# Altium project QBW01.PrjPCB
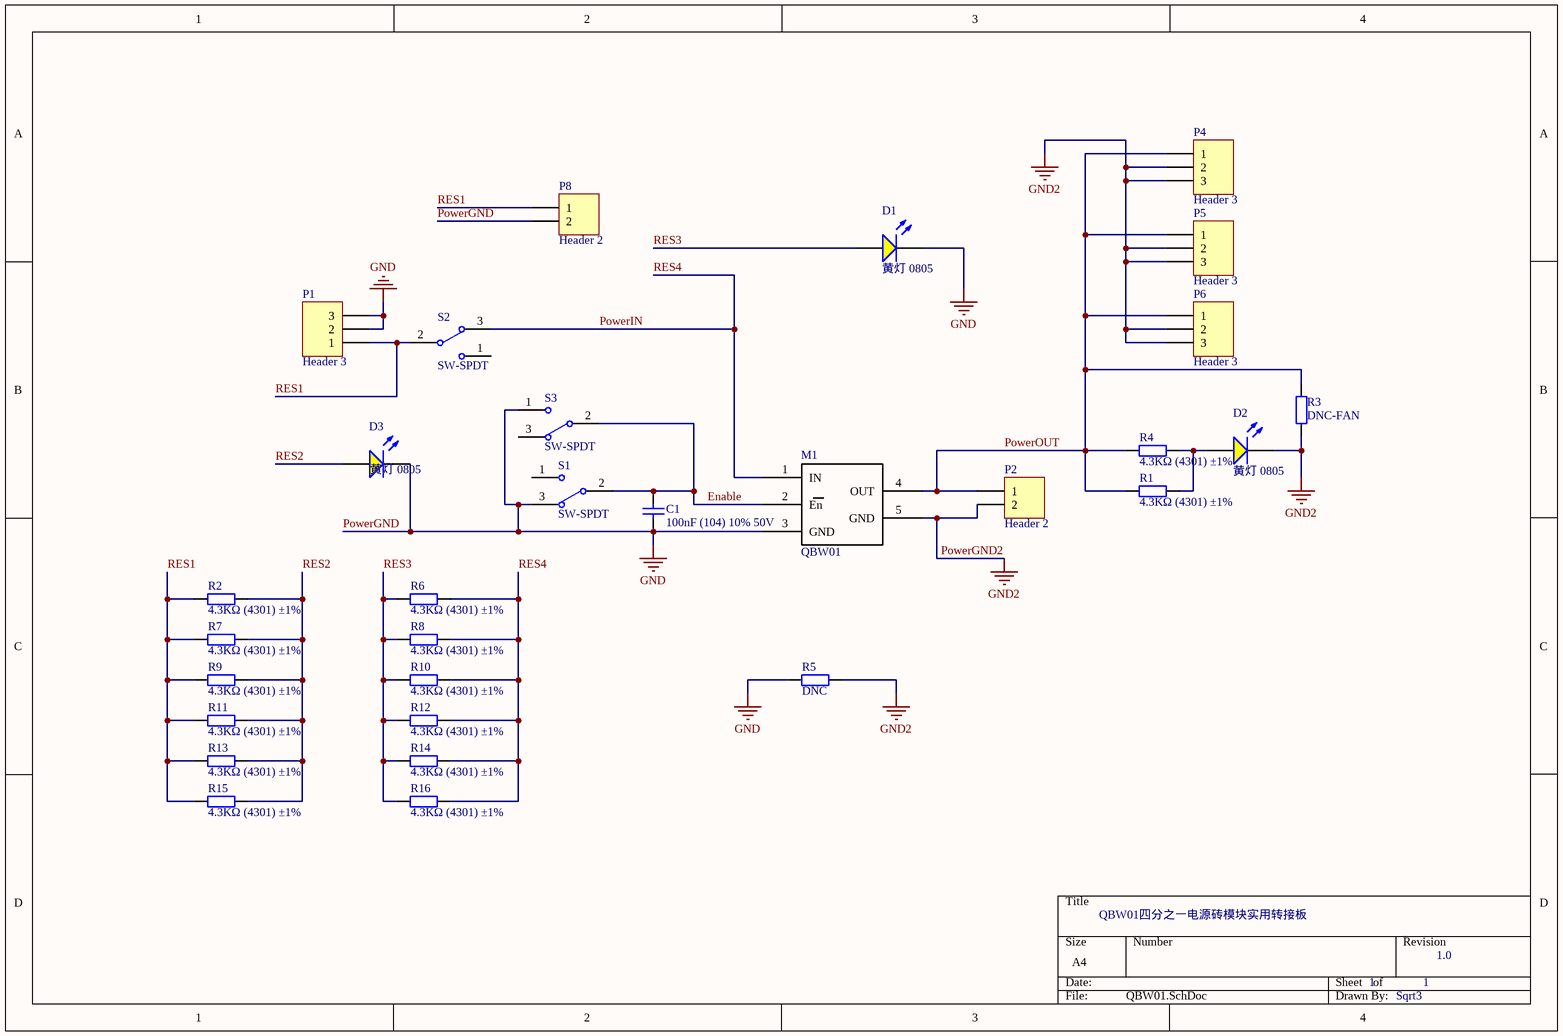
[diagram p0: QBW01.SchDoc]
1 sheet, 30 parts. Net scope: global (net labels, ports and power ports of the same name join across sheets).
Board file: QBW01.PcbDoc

## Sheet QBW01.SchDoc
size A4

### Parts
C1  100nF (104) 10% 50V  [0603_C]
D1  黄灯 0805  [0805_LED_S1]
D2  黄灯 0805  [0805_LED_S1]
D3  黄灯 0805  [0805_LED_S1]
M1  QBW01  [QBW01]
P1  Header 3  [PCBComponent_1]
P2  Header 2  [Header 1X2]
P4  Header 3  [PCBComponent_1]
P5  Header 3  [PCBComponent_1]
P6  Header 3  [PCBComponent_1]
P8  Header 2  [Header 1X2]
R1  4.3KΩ (4301) ±1%  [0805_R]
R2  4.3KΩ (4301) ±1%  [0805_R]
R3  DNC-FAN  [1206_R]
R4  4.3KΩ (4301) ±1%  [0805_R]
R5  DNC  [1206_R]
R6  4.3KΩ (4301) ±1%  [0805_R]
R7  4.3KΩ (4301) ±1%  [0805_R]
R8  4.3KΩ (4301) ±1%  [0805_R]
R9  4.3KΩ (4301) ±1%  [0805_R]
R10  4.3KΩ (4301) ±1%  [0805_R]
R11  4.3KΩ (4301) ±1%  [0805_R]
R12  4.3KΩ (4301) ±1%  [0805_R]
R13  4.3KΩ (4301) ±1%  [0805_R]
R14  4.3KΩ (4301) ±1%  [0805_R]
R15  4.3KΩ (4301) ±1%  [0805_R]
R16  4.3KΩ (4301) ±1%  [0805_R]
S1  SW-SPDT  [SWITCH-SS12D07]
S2  SW-SPDT  [SWITCH-YF]
S3  SW-SPDT  [SWITCH-YF]

### Nets
PowerGND: C1.1 D1.K D3.K M1.3(GND) P1.2 P1.3 P8.2 R5.1 S1.3 S3.1  [also labelled GND]
PowerGND2: D2.K M1.5(GND) P2.2 P4.2 P4.3 P5.2 P5.3 P6.2 P6.3 R3.1 R5.2  [also labelled GND2]
Enable: C1.2 M1.2(En) S1.2 S3.2
PowerIN: M1.1(IN) R6.2 R8.2 R10.2 R12.2 R14.2 R16.2 S2.3  [also labelled RES4]
PowerOUT: M1.4(OUT) P2.1 P4.1 P5.1 P6.1 R1.1 R3.2 R4.1
RES1: P1.1 P8.1 R2.1 R7.1 R9.1 R11.1 R13.1 R15.1 S2.2
RES2: D3.A R2.2 R7.2 R9.2 R11.2 R13.2 R15.2
RES3: D1.A R6.1 R8.1 R10.1 R12.1 R14.1 R16.1
NetD2_A: D2.A R1.2 R4.2

Not connected (* = marked no-connect by the designer): S1 1; S2 1; S3 3

### Notes on the sheet
- QBW01四分之一电源砖模块实用转接板
- 1
- 1.0
- Sqrt3

### Library data of the parts
C1 = 0603 100nF (104) 10% 50V: 贴片电容; ComponentLink1Description: 供应商链接; ComponentLink1URL: http://www.szlcsc.com/product/details_15331.html; Package: 0603; Supplier: LC; SuppliersPartNumber: C14663
D1-D3 = 0805 黄灯: 发光二极管; ComponentLink1Description: 供应商链接; ComponentLink1URL: http://www.szlcsc.com/product/details_2669.html; Package: 0805; Supplier: LC; SuppliersPartNumber: C2296
P1 P4-P6 = Header 3: Header, 3-Pin; LatestRevisionDate: 17-Jul-2002; LatestRevisionNote: Re-released for DXP Platform.; Publisher: Altium Limited
P2 P8 = Header 2: Header, 2-Pin; LatestRevisionDate: 17-Jul-2002; LatestRevisionNote: Re-released for DXP Platform.; Publisher: Altium Limited
R1 R2 R4 R6-R16 = 0805 4.3KΩ (4301) 1%: 贴片电阻; ComponentLink1Description: 供应商链接; ComponentLink1URL: http://www.szlcsc.com/product/details_18355.html; Package: 0805; Supplier: LC; SuppliersPartNumber: C17667
R3 R5 = 1206 1KΩ (1001) 1%: 贴片电阻; ComponentLink1Description: 供应商链接; ComponentLink1URL: http://www.szlcsc.com/product/details_4817.html; Package: 1206; Supplier: LC; SuppliersPartNumber: C4410
S1-S3 = SW-SPDT: SPDT Subminiature Toggle Switch, Right Angle Mounting, Vertical Actuation; Published: 24-Mar-1999; LatestRevisionDate: 17-Dec-2003; LatestRevisionNote: Schematic revised, PCB Footprint replaced.; DatasheetVersion: 05-Dec-2000; PackageReference: TL36WW15050; Publisher: Altium Limited; PackageDescription: Switch; 4 Leads; ComponentLink1Description: Manufacturer Link; ComponentLink1URL: http://www.apem.com